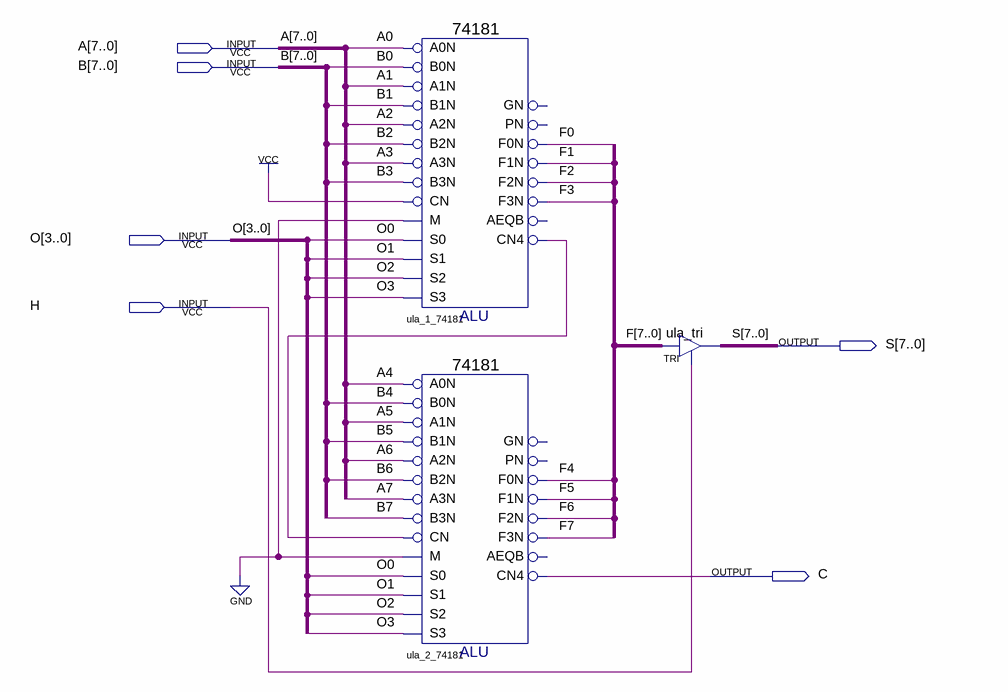
[diagram p0: schematic sheet]
// Quartus schematic ULA_UnidadeLogicaEAritmetica.bdf as structural Verilog: 3 symbols, 6 pins
module ULA_UnidadeLogicaEAritmetica (
  input  [7:0] A,
  input  [7:0] B,
  input  [3:0] O,
  input  H,
  output [7:0] S,
  output C
);

  wire ula_1_74181_cn4;
  wire [7:0] F;

  \74181  ula_1_74181 (
    .B0N(B[0]), .A0N(A[0]), .A1N(A[1]), .B1N(B[1]), .A3N(A[3]), .B2N(B[2]), .A2N(A[2]), .M(1'b0), .CN(1'b1),
    .B3N(B[3]), .S2(O[2]), .S1(O[1]), .S0(O[0]), .S3(O[3]), .F3N(F[3]), .F1N(F[1]), .F0N(F[0]),
    .CN4(ula_1_74181_cn4), .F2N(F[2]));  // open: PN, GN, AEQB
  \74181  ula_2_74181 (
    .B0N(B[4]), .A0N(A[4]), .A1N(A[5]), .B1N(B[5]), .A3N(A[7]), .B2N(B[6]), .A2N(A[6]), .M(1'b0),
    .CN(ula_1_74181_cn4), .B3N(B[7]), .S2(O[2]), .S1(O[1]), .S0(O[0]), .S3(O[3]), .F3N(F[7]), .F1N(F[5]),
    .F0N(F[4]), .CN4(C), .F2N(F[6]));  // open: PN, GN, AEQB
  TRI ula_tri[7:0] (.IN(F), .OE(H), .OUT(S));
endmodule
